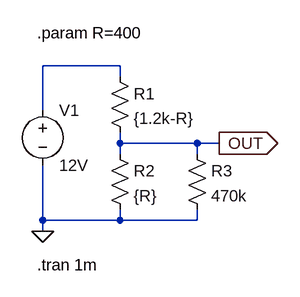
[diagram p0: schematic Couarce_SW_470k_LowImp.asc]
Couarce_SW_470k_LowImp.asc, the LTspice schematic file:
Version 4
SHEET 1 880 680
WIRE 80 64 -32 64
WIRE 80 80 80 64
WIRE -32 128 -32 64
WIRE 80 176 80 160
WIRE 192 176 80 176
WIRE 224 176 192 176
WIRE 80 192 80 176
WIRE 192 192 192 176
WIRE -32 288 -32 208
WIRE 80 288 80 272
WIRE 80 288 -32 288
WIRE 192 288 192 272
WIRE 192 288 80 288
WIRE -32 304 -32 288
FLAG -32 304 0
FLAG 224 176 OUT
IOPIN 224 176 Out
SYMBOL res 64 64 R0
SYMATTR InstName R1
SYMATTR Value {1.2k-R}
SYMBOL res 64 176 R0
SYMATTR InstName R2
SYMATTR Value {R}
SYMBOL res 176 176 R0
SYMATTR InstName R3
SYMATTR Value 470k
SYMBOL voltage -32 112 R0
WINDOW 123 0 0 Left 0
WINDOW 39 0 0 Left 0
SYMATTR InstName V1
SYMATTR Value 12V
TEXT -40 16 Left 2 !.param R=400
TEXT -40 352 Left 2 !.tran 1m

The netlist it stands for:
* Couarce_SW_470k_LowImp.asc
R1 N001 OUT {1.2k-R}
R2 OUT 0 {R}
R3 OUT 0 470k
V1 N001 0 12V
.param R=400
.tran 1m
.backanno
.end